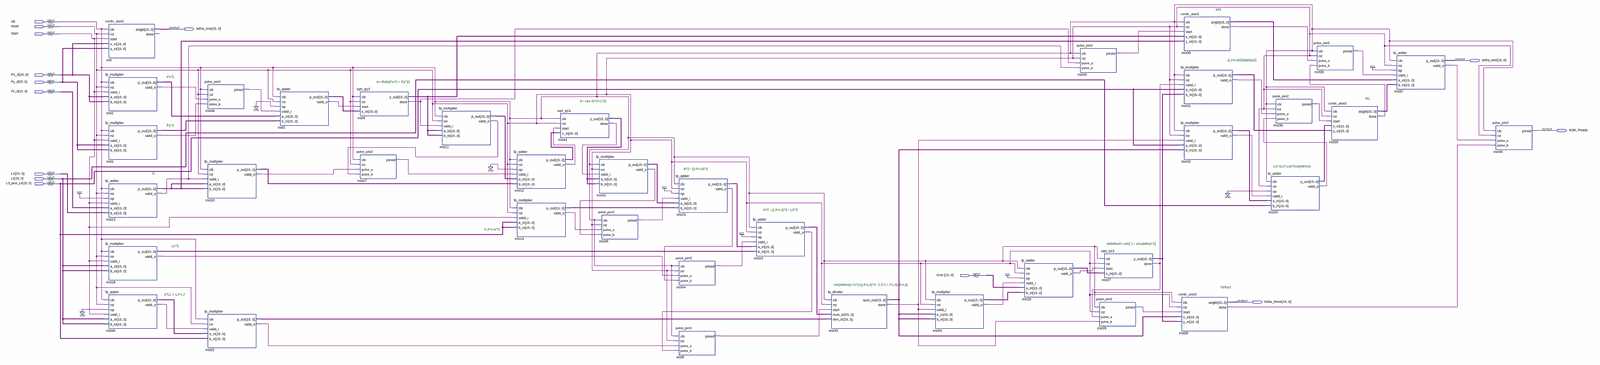
[diagram p0: schematic sheet, whole]
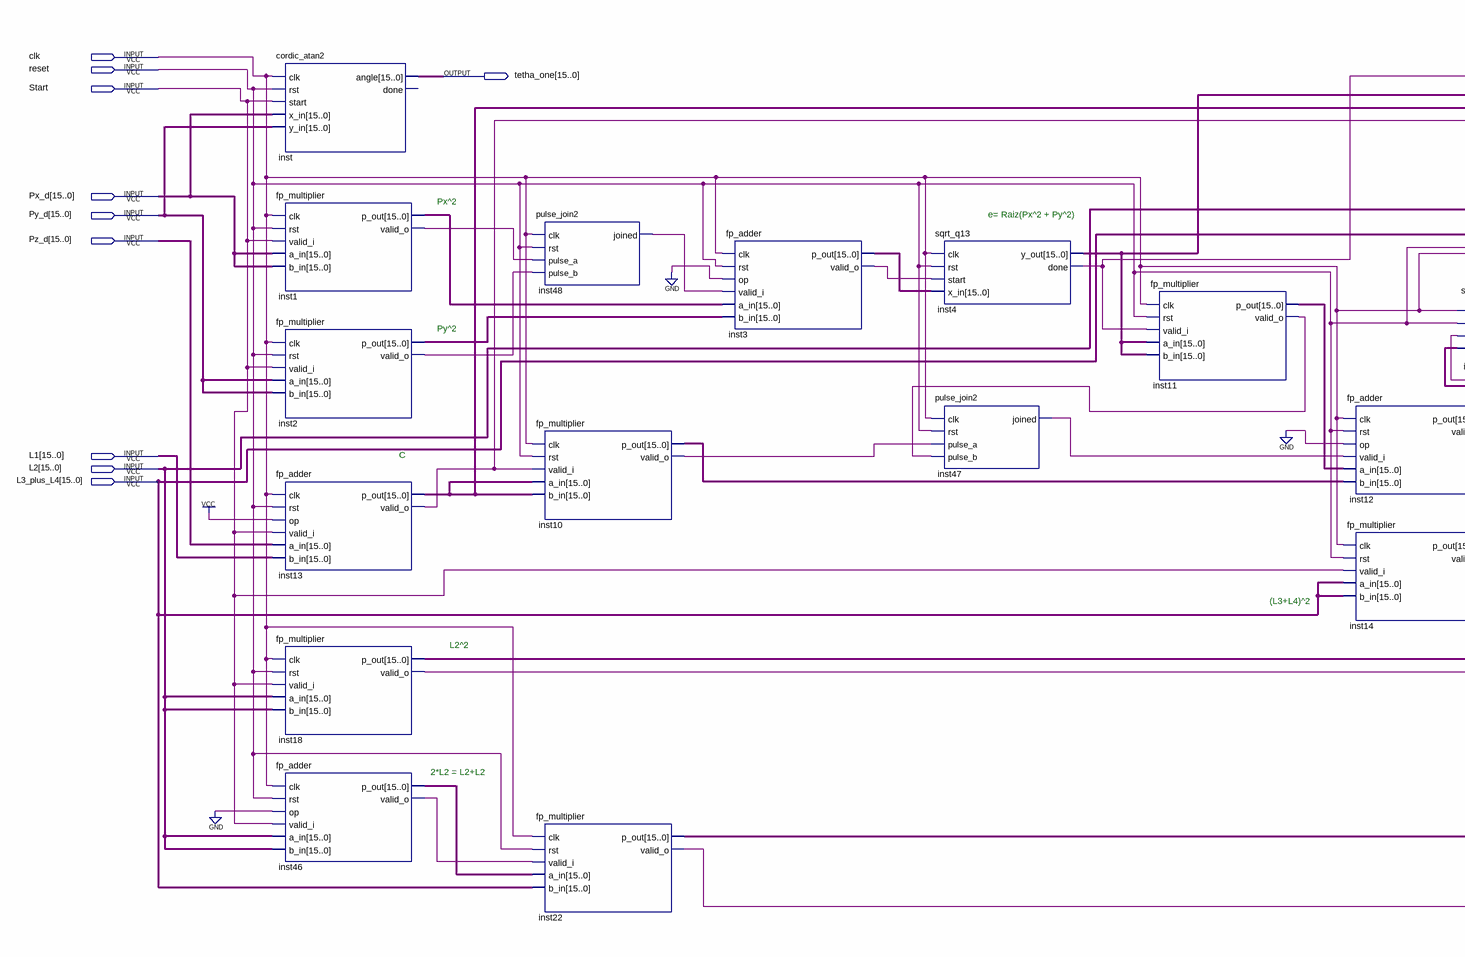
[diagram p1: schematic sheet, left part]
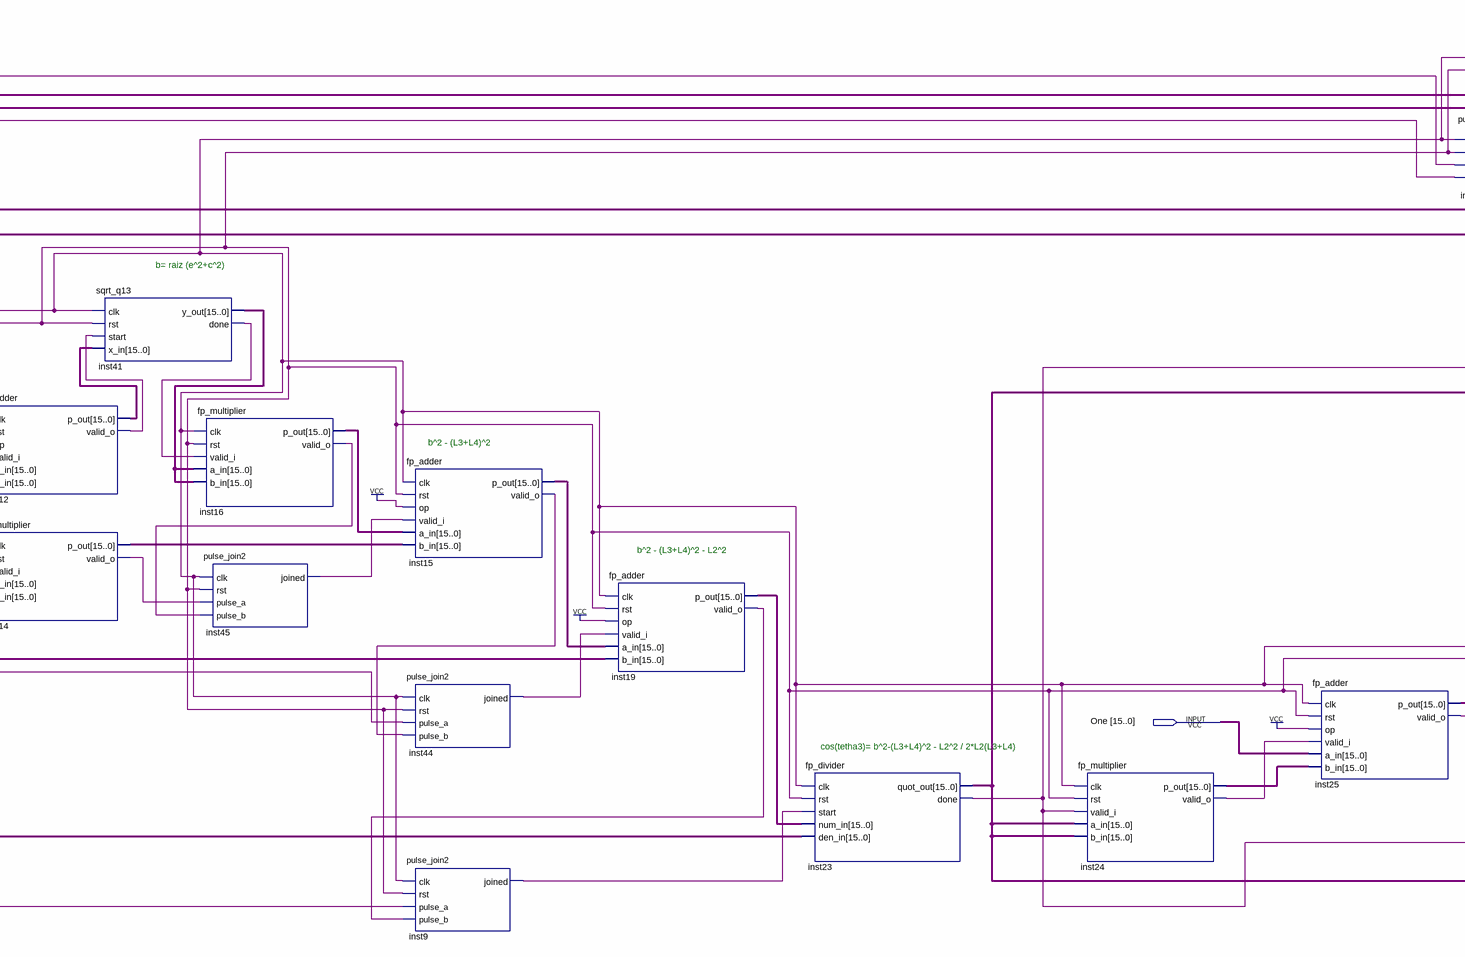
[diagram p2: schematic sheet, centre part]
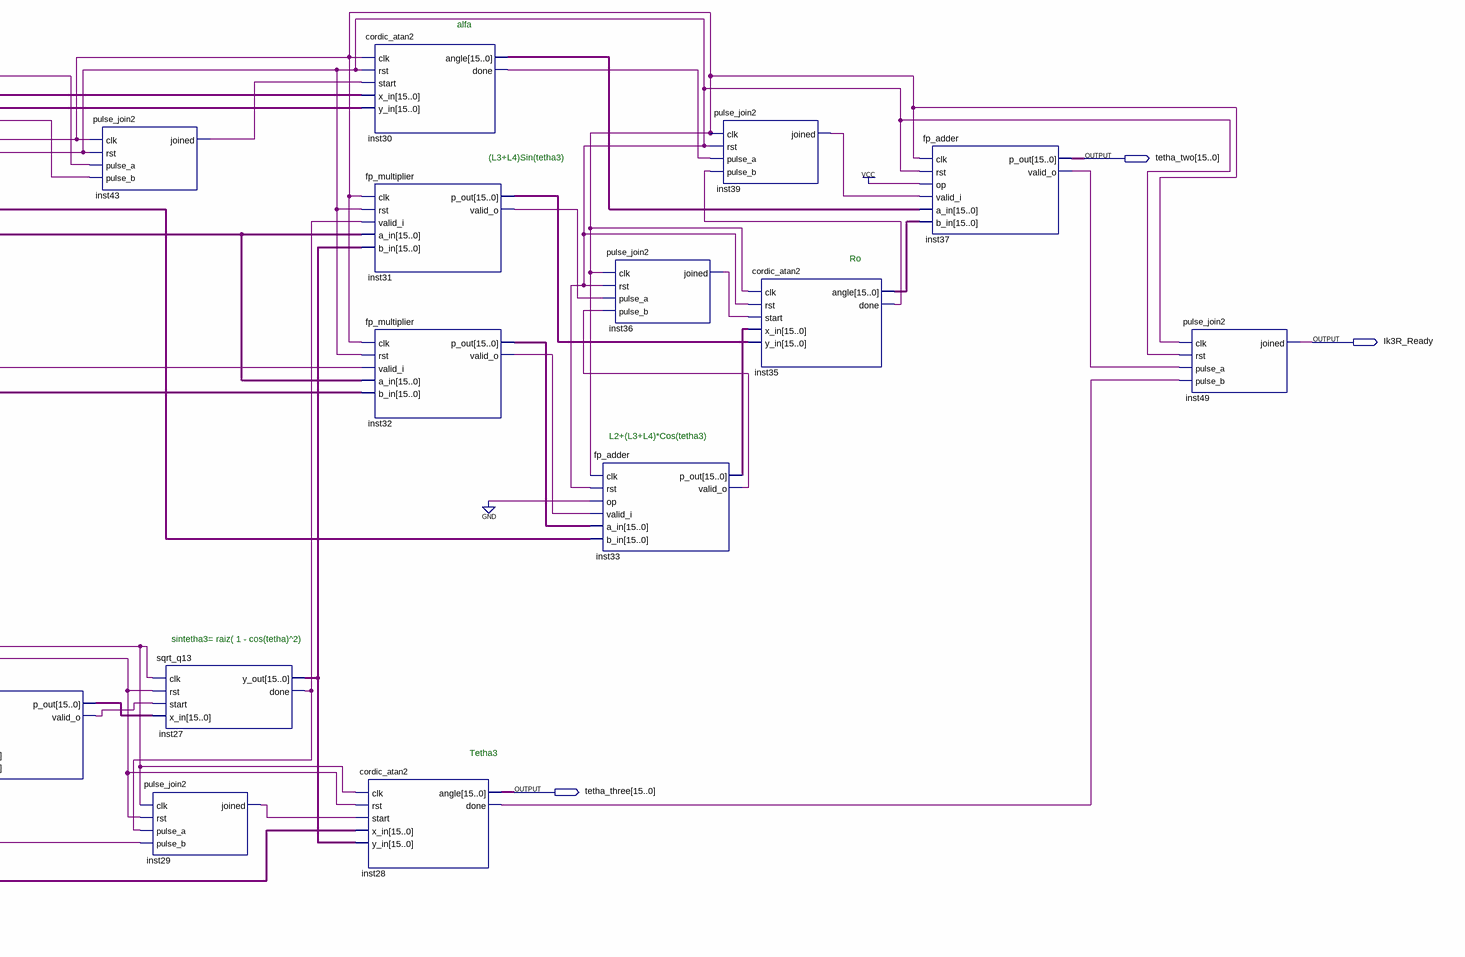
[diagram p3: schematic sheet, right part]
// Quartus schematic Cinematica_Inversa3R.bdf as structural Verilog: 38 symbols, 14 pins
module Cinematica_Inversa3R (
  input  clk,
  input  reset,
  input  Start,
  input  [15:0] Px_d,
  input  [15:0] Py_d,
  input  [15:0] Pz_d,
  input  [15:0] L1,
  input  [15:0] L2,
  input  [15:0] L3_plus_L4,
  input  [15:0] One,
  output [15:0] tetha_one,
  output [15:0] tetha_two,
  output Ik3R_Ready,
  output [15:0] tetha_three
);

  wire inst1_valid_o, inst2_valid_o, inst3_valid_o, inst4_done, inst9_joined, inst10_valid_o, inst11_valid_o,
       inst12_valid_o, inst13_valid_o, inst14_valid_o, inst15_valid_o, inst16_valid_o, inst18_valid_o,
       inst19_valid_o, inst22_valid_o, inst23_done, inst24_valid_o, inst25_valid_o, inst27_done, inst28_done,
       inst29_joined, inst30_done, inst31_valid_o, inst32_valid_o, inst33_valid_o, inst35_done,
       inst36_joined, inst37_valid_o, inst39_joined, inst41_done, inst43_joined, inst44_joined,
       inst45_joined, inst46_valid_o, inst47_joined, inst48_joined;
  wire [15:0] inst1_p_out, inst2_p_out, inst3_p_out, inst4_y_out, inst10_p_out, inst11_p_out, inst12_p_out,
       inst13_p_out, inst14_p_out, inst15_p_out, inst16_p_out, inst18_p_out, inst19_p_out, inst22_p_out,
       inst23_quot_out, inst24_p_out, inst25_p_out, inst27_y_out, inst30_angle, inst31_p_out, inst32_p_out,
       inst33_p_out, inst35_angle, inst41_y_out, inst46_p_out;

  cordic_atan2 inst (.clk(clk), .rst(reset), .start(Start), .x_in(Px_d), .y_in(Py_d), .angle(tetha_one));  // open: done
  fp_multiplier inst1 (
    .clk(clk), .rst(reset), .valid_i(Start), .a_in(Px_d), .b_in(Px_d), .p_out(inst1_p_out),
    .valid_o(inst1_valid_o));
  fp_multiplier inst2 (
    .clk(clk), .rst(reset), .valid_i(Start), .a_in(Py_d), .b_in(Py_d), .p_out(inst2_p_out),
    .valid_o(inst2_valid_o));
  fp_adder inst13 (
    .clk(clk), .rst(reset), .op(1'b1), .valid_i(Start), .a_in(Pz_d), .b_in(L1), .p_out(inst13_p_out),
    .valid_o(inst13_valid_o));
  fp_multiplier inst18 (
    .clk(clk), .rst(reset), .valid_i(Start), .a_in(L2), .b_in(L2), .p_out(inst18_p_out),
    .valid_o(inst18_valid_o));
  fp_adder inst46 (
    .clk(clk), .rst(reset), .op(1'b0), .valid_i(Start), .a_in(L2), .b_in(L2), .p_out(inst46_p_out),
    .valid_o(inst46_valid_o));
  pulse_join2 inst48 (.clk(clk), .rst(reset), .pulse_a(inst1_valid_o), .pulse_b(inst2_valid_o), .joined(inst48_joined));
  fp_multiplier inst10 (
    .clk(clk), .rst(reset), .valid_i(inst13_valid_o), .a_in(inst13_p_out), .b_in(inst13_p_out),
    .p_out(inst10_p_out), .valid_o(inst10_valid_o));
  fp_multiplier inst22 (
    .clk(clk), .rst(reset), .valid_i(inst46_valid_o), .a_in(inst46_p_out), .b_in(L3_plus_L4),
    .p_out(inst22_p_out), .valid_o(inst22_valid_o));
  fp_adder inst3 (
    .clk(clk), .rst(reset), .op(1'b0), .valid_i(inst48_joined), .a_in(inst1_p_out), .b_in(inst2_p_out),
    .p_out(inst3_p_out), .valid_o(inst3_valid_o));
  sqrt_q13 inst4 (
    .clk(clk), .rst(reset), .start(inst3_valid_o), .x_in(inst3_p_out), .y_out(inst4_y_out), .done(inst4_done));
  pulse_join2 inst47 (
    .clk(clk), .rst(reset), .pulse_a(inst10_valid_o), .pulse_b(inst11_valid_o), .joined(inst47_joined));
  fp_multiplier inst11 (
    .clk(clk), .rst(reset), .valid_i(inst4_done), .a_in(inst4_y_out), .b_in(inst4_y_out),
    .p_out(inst11_p_out), .valid_o(inst11_valid_o));
  fp_adder inst12 (
    .clk(clk), .rst(reset), .op(1'b0), .valid_i(inst47_joined), .a_in(inst11_p_out), .b_in(inst10_p_out),
    .p_out(inst12_p_out), .valid_o(inst12_valid_o));
  fp_multiplier inst14 (
    .clk(clk), .rst(reset), .valid_i(Start), .a_in(L3_plus_L4), .b_in(L3_plus_L4), .p_out(inst14_p_out),
    .valid_o(inst14_valid_o));
  sqrt_q13 inst41 (
    .clk(clk), .rst(reset), .start(inst12_valid_o), .x_in(inst12_p_out), .y_out(inst41_y_out),
    .done(inst41_done));
  fp_multiplier inst16 (
    .clk(clk), .rst(reset), .valid_i(inst41_done), .a_in(inst41_y_out), .b_in(inst41_y_out),
    .p_out(inst16_p_out), .valid_o(inst16_valid_o));
  pulse_join2 inst45 (
    .clk(clk), .rst(reset), .pulse_a(inst14_valid_o), .pulse_b(inst16_valid_o), .joined(inst45_joined));
  fp_adder inst15 (
    .clk(clk), .rst(reset), .op(1'b1), .valid_i(inst45_joined), .a_in(inst16_p_out), .b_in(inst14_p_out),
    .p_out(inst15_p_out), .valid_o(inst15_valid_o));
  pulse_join2 inst44 (
    .clk(clk), .rst(reset), .pulse_a(inst18_valid_o), .pulse_b(inst15_valid_o), .joined(inst44_joined));
  pulse_join2 inst9 (.clk(clk), .rst(reset), .pulse_a(inst22_valid_o), .pulse_b(inst19_valid_o), .joined(inst9_joined));
  fp_adder inst19 (
    .clk(clk), .rst(reset), .op(1'b1), .valid_i(inst44_joined), .a_in(inst15_p_out), .b_in(inst18_p_out),
    .p_out(inst19_p_out), .valid_o(inst19_valid_o));
  fp_divider inst23 (
    .clk(clk), .rst(reset), .start(inst9_joined), .num_in(inst19_p_out), .den_in(inst22_p_out),
    .quot_out(inst23_quot_out), .done(inst23_done));
  fp_multiplier inst24 (
    .clk(clk), .rst(reset), .valid_i(inst23_done), .a_in(inst23_quot_out), .b_in(inst23_quot_out),
    .p_out(inst24_p_out), .valid_o(inst24_valid_o));
  fp_adder inst25 (
    .clk(clk), .rst(reset), .op(1'b1), .valid_i(inst24_valid_o), .a_in(One), .b_in(inst24_p_out),
    .p_out(inst25_p_out), .valid_o(inst25_valid_o));
  pulse_join2 inst43 (.clk(clk), .rst(reset), .pulse_a(inst4_done), .pulse_b(inst13_valid_o), .joined(inst43_joined));
  sqrt_q13 inst27 (
    .clk(clk), .rst(reset), .start(inst25_valid_o), .x_in(inst25_p_out), .y_out(inst27_y_out),
    .done(inst27_done));
  pulse_join2 inst29 (.clk(clk), .rst(reset), .pulse_a(inst27_done), .pulse_b(inst23_done), .joined(inst29_joined));
  cordic_atan2 inst30 (
    .clk(clk), .rst(reset), .start(inst43_joined), .x_in(inst4_y_out), .y_in(inst13_p_out),
    .angle(inst30_angle), .done(inst30_done));
  fp_multiplier inst31 (
    .clk(clk), .rst(reset), .valid_i(inst27_done), .a_in(L3_plus_L4), .b_in(inst27_y_out),
    .p_out(inst31_p_out), .valid_o(inst31_valid_o));
  fp_multiplier inst32 (
    .clk(clk), .rst(reset), .valid_i(inst23_done), .a_in(L3_plus_L4), .b_in(inst23_quot_out),
    .p_out(inst32_p_out), .valid_o(inst32_valid_o));
  cordic_atan2 inst28 (
    .clk(clk), .rst(reset), .start(inst29_joined), .x_in(inst23_quot_out), .y_in(inst27_y_out),
    .angle(tetha_three), .done(inst28_done));
  pulse_join2 inst36 (
    .clk(clk), .rst(reset), .pulse_a(inst31_valid_o), .pulse_b(inst33_valid_o), .joined(inst36_joined));
  fp_adder inst33 (
    .clk(clk), .rst(reset), .op(1'b0), .valid_i(inst32_valid_o), .a_in(inst32_p_out), .b_in(L2),
    .p_out(inst33_p_out), .valid_o(inst33_valid_o));
  pulse_join2 inst39 (.clk(clk), .rst(reset), .pulse_a(inst30_done), .pulse_b(inst35_done), .joined(inst39_joined));
  cordic_atan2 inst35 (
    .clk(clk), .rst(reset), .start(inst36_joined), .x_in(inst33_p_out), .y_in(inst31_p_out),
    .angle(inst35_angle), .done(inst35_done));
  fp_adder inst37 (
    .clk(clk), .rst(reset), .op(1'b1), .valid_i(inst39_joined), .a_in(inst30_angle), .b_in(inst35_angle),
    .p_out(tetha_two), .valid_o(inst37_valid_o));
  pulse_join2 inst49 (.clk(clk), .rst(reset), .pulse_a(inst37_valid_o), .pulse_b(inst28_done), .joined(Ik3R_Ready));

  // Notes on the sheet:
  //   alfa
  //   (L3+L4)Sin(tetha3)
  //   Px^2
  //   e= Raiz(Px^2 + Py^2)
  //   Ro
  //   b= raiz (e^2+c^2)
  //   Py^2
  //   L2+(L3+L4)*Cos(tetha3)
  //   b^2 - (L3+L4)^2
  //   C
  //   b^2 - (L3+L4)^2 - L2^2
  //    (L3+L4)^2
  //   sintetha3= raiz( 1 - cos(tetha)^2)
  //   L2^2
  //   cos(tetha3)= b^2-(L3+L4)^2 - L2^2 / 2*L2(L3+L4)
  //   Tetha3
  //   2*L2 = L2+L2
endmodule
